# EAGLE design QFN20 (EAGLE 6.0)
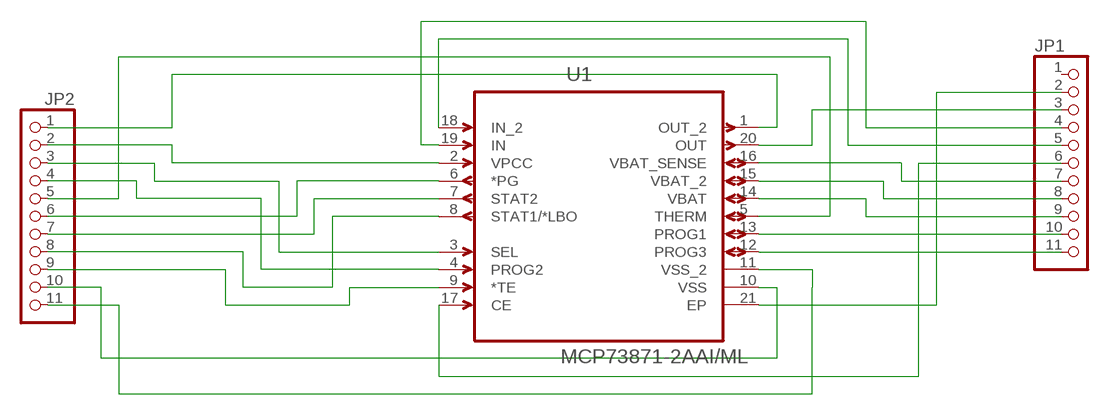
[diagram p0: schematic, sheet 1]

## Parts
JP1  PINHD-1X11  [1X11]
JP2  PINHD-1X11  [1X11]
U1  MCP73871-2AAI/ML  [QFN50P400X400X100-21N]

## Nets
N$1: JP2.1 U1.1(OUT_2)
N$2: JP2.2 U1.2(VPCC)
N$3: JP2.3 U1.3(SEL)
N$4: JP2.4 U1.4(PROG2)
N$5: JP2.5 U1.5(THERM)
N$6: JP2.6 U1.6(*PG)
N$7: JP2.7 U1.7(STAT2)
N$8: JP2.8 U1.8(STAT1/*LBO)
N$9: JP2.9 U1.9(*TE)
N$10: JP2.10 U1.10(VSS)
N$11: JP2.11 U1.11(VSS_2)
N$12: JP1.11 U1.12(PROG3)
N$13: JP1.10 U1.13(PROG1)
N$14: JP1.9 U1.14(VBAT)
N$15: JP1.8 U1.15(VBAT_2)
N$16: JP1.7 U1.16(VBAT_SENSE)
N$17: JP1.6 U1.17(CE)
N$18: JP1.5 U1.18(IN_2)
N$19: JP1.4 U1.19(IN)
N$20: JP1.3 U1.20(OUT)
N$21: JP1.2 U1.21(EP)
Unconnected: JP1.1

## Library data of the parts
JP1 JP2 = pinhead:PINHD-1X11: PIN HEADER
U1 = Microchip-MCP73871-2AAI_ML:MCP73871-2AAI/ML: IC, BATTERY CHARGER, 1A; MPN: MCP73871-2AAI/ML; OC_FARNELL: 1642487; OC_NEWARK: 54M4955; PACKAGE: QFN-20; SUPPLIER: Microchip

## Board
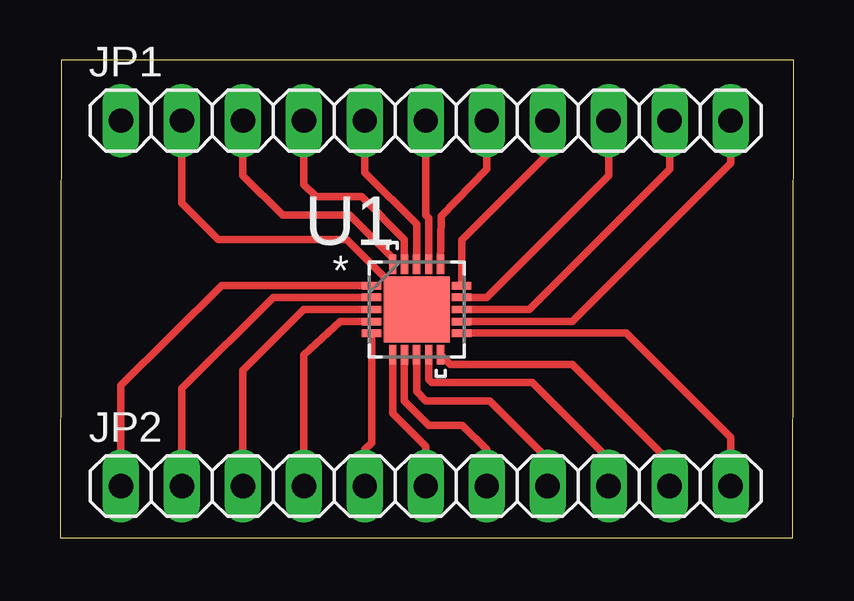
[diagram p1: board, top side]

Size 30.58 x 19.93 mm. Coordinates in mm from the lower left corner, seen from the top.
Outline: 0,0 30.53,0 30.58,19.93 0.05,19.93 0,0
Copper layers (1*16): Top 0.035mm / dielectric 1.5mm / Bottom 0.035mm
Design rules: minimum track width 10mil, minimum drill 24mil, track to track 8mil, track to pad 8mil, pad to pad 8mil, via to via 8mil, smd to smd 8mil, copper to edge 40mil, drill to drill 8mil, minimum pad ring 10mil, minimum via ring 8mil, stop-mask expansion 4mil, vias tented up to drill 0mil, thermal gap 10mil

### Footprints (pad centres in the part's own frame; a part is rotated, then mirrored left to right if it is on the bottom)
1X11 = drill 1.016 long: 1 -12.7,0; 2 -10.16,0; 3 -7.62,0; 4 -5.08,0; 5 -2.54,0; 6 0,0; 7 2.54,0; 8 5.08,0; 9 7.62,0; 10 10.16,0; 11 12.7,0
QFN50P400X400X100-21N = smd 0.813 x 0.305: 1 -1.88,0.991; 2 -1.88,0.508; 3 -1.88,0; 4 -1.88,-0.508; 5 -1.88,-0.991; 11 1.88,-0.991; 12 1.88,-0.508; 13 1.88,0; 14 1.88,0.508; 15 1.88,0.991 | smd 0.305 x 0.813: 6 -0.991,-1.88; 7 -0.508,-1.88; 8 0,-1.88; 9 0.508,-1.88; 10 0.991,-1.88; 16 0.991,1.88; 17 0.508,1.88; 18 0,1.88; 19 -0.508,1.88; 20 -0.991,1.88 | smd 2.743 x 2.743: 21 0,0

### Placement (x,y rotation side)
JP1  15.24,17.4 0 top
JP2  15.24,2.16 0 top
U1  14.86,9.53 0 top

### Tracks (layer width: path | path; a pad name or v marks a point on that pad's centre or on a via)
N$1
  Top 0.305: JP2.1 2.54,6.35 6.73,10.52 12.83,10.52 U1.1
N$2
  Top 0.305: U1.2 8.89,10.03 5.08,6.22 JP2.2
N$3
  Top 0.305: U1.3 10.16,9.53 7.62,6.99 JP2.3
N$4
  Top 0.305: U1.4 11.68,9.02 10.16,7.62 10.16,2.29 JP2.4
N$5
  Top 0.305: U1.5 12.98,3.96 12.7,3.68 JP2.5
N$6
  Top 0.305: U1.6 13.87,5.18 15.24,3.81 JP2.6
N$7
  Top 0.305: U1.7 14.35,5.71 15.37,4.7 16.76,4.7 17.78,3.68 JP2.7
N$8
  Top 0.305: U1.8 14.86,6.1 15.24,5.71 17.91,5.71 20.32,3.3 JP2.8
N$9
  Top 0.305: U1.9 15.37,6.6 15.49,6.48 19.68,6.48 22.86,3.3 JP2.9
N$10
  Top 0.305: U1.10 16.26,7.24 21.34,7.24 25.4,3.17 JP2.10
N$11
  Top 0.305: U1.11 23.6,8.53 27.94,4.19 JP2.11
N$12
  Top 0.305: U1.12 21.34,9.02 27.94,15.62 JP1.11
N$13
  Top 0.305: U1.13 19.56,9.53 25.4,15.37 JP1.10
N$14
  Top 0.305: U1.14 17.78,10.03 22.86,15.11 JP1.9
N$15
  Top 0.305: U1.15 16.74,12.42 20.32,16 JP1.8
N$16
  Top 0.305: U1.16 15.88,13.41 17.78,15.37 JP1.7
N$17
  Top 0.305: JP1.6 15.24,13.46 15.37,13.34 U1.17
N$18
  Top 0.305: U1.18 14.86,13.08 12.7,15.24 JP1.5
N$19
  Top 0.305: JP1.4 10.16,14.73 10.67,14.22 12.57,14.22 14.35,12.45 U1.19
N$20
  Top 0.305: U1.20 13.87,11.66 12.06,13.46 9.27,13.46 7.62,15.11 JP1.3
N$21
  Top 0.305: JP1.2 5.08,13.97 6.6,12.45 11.94,12.45 U1.21